# Altium schematic sheet Sheet_1.schdoc
size 366 x 250 mm
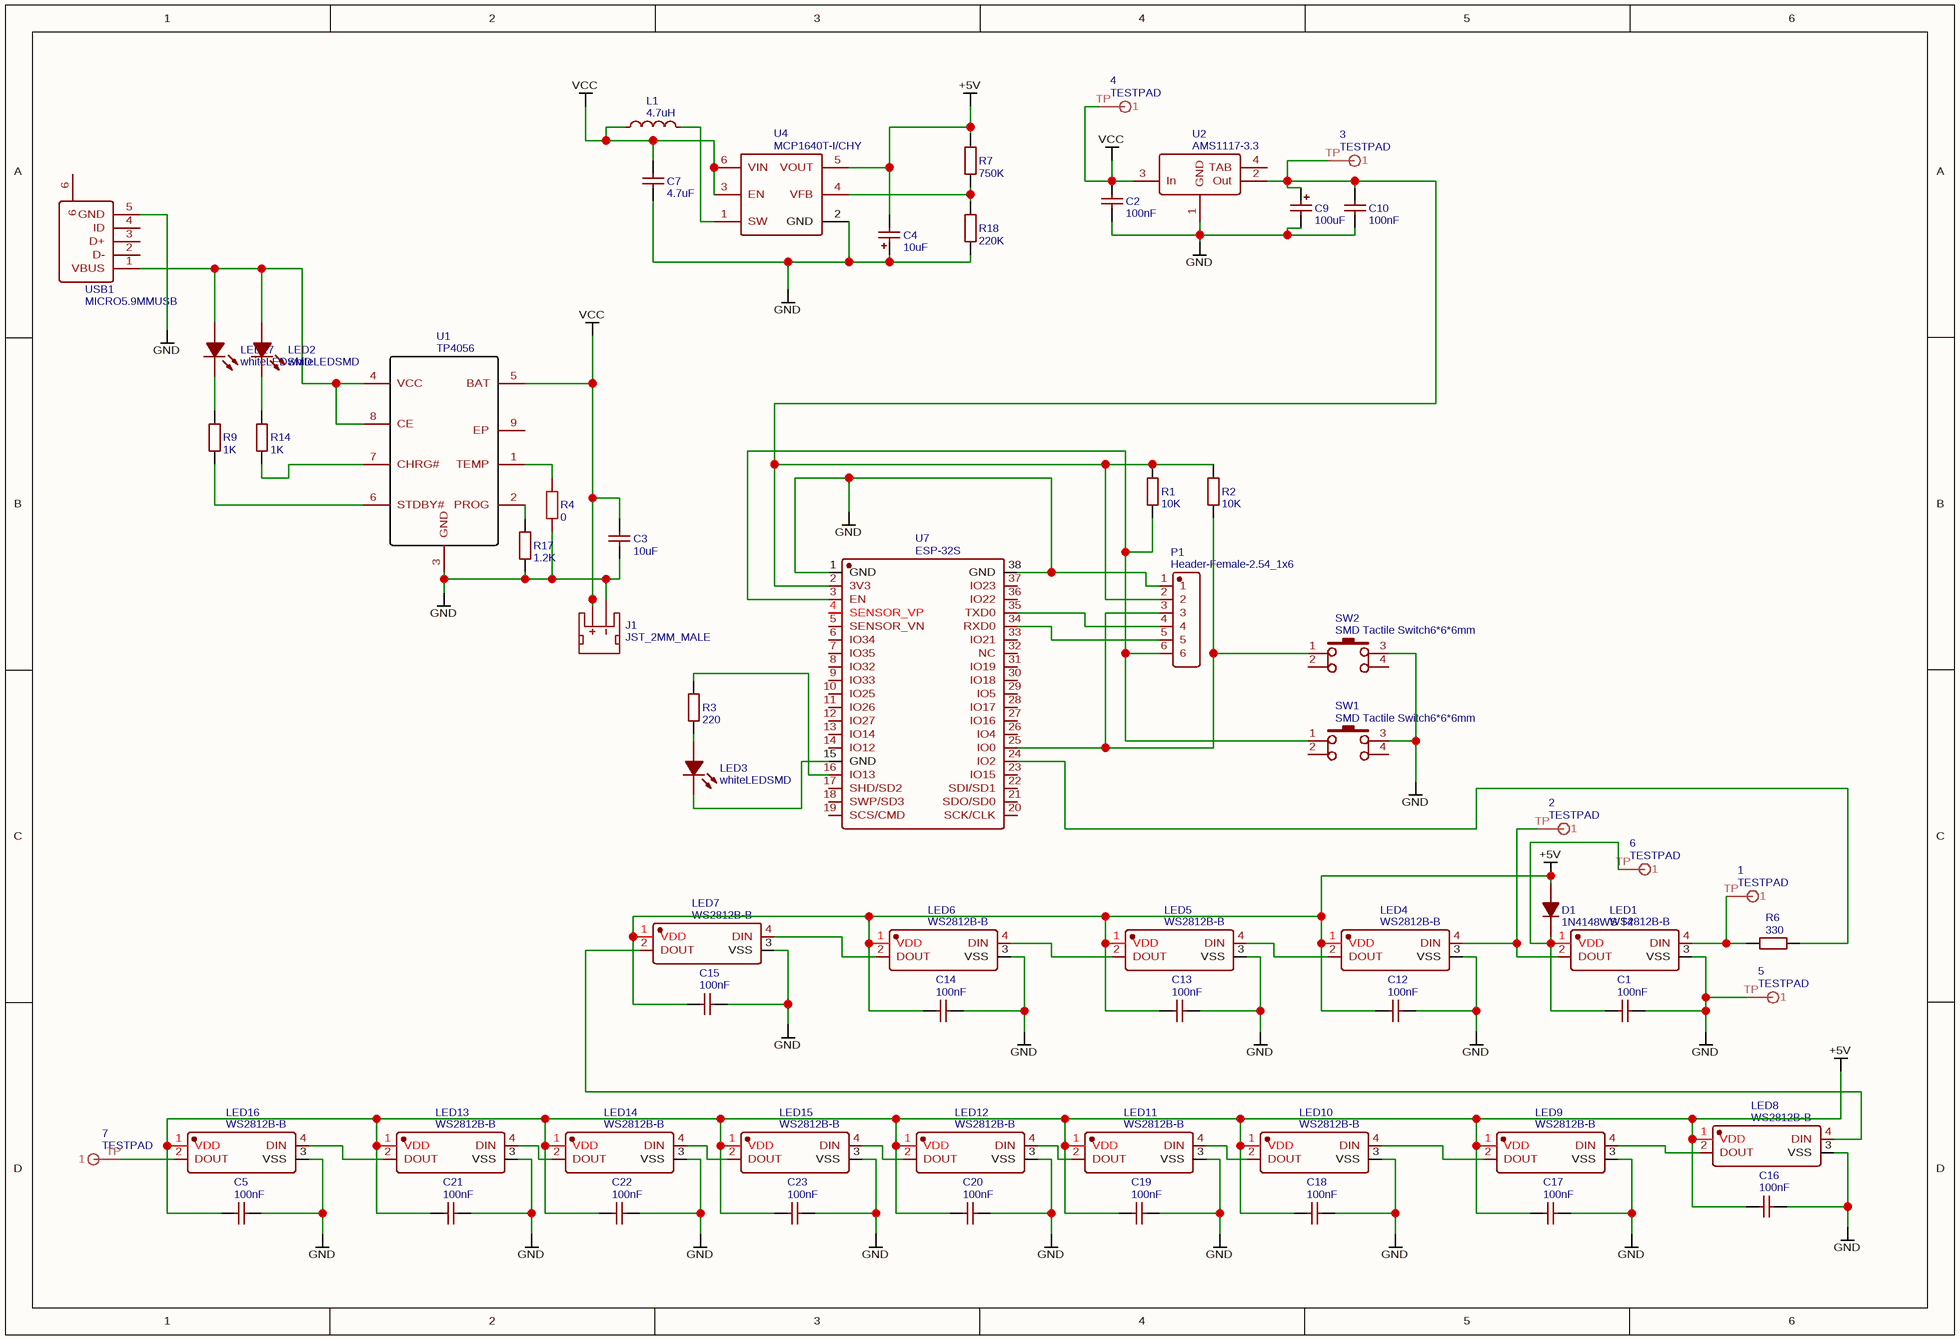
[diagram p0: Sheet_1.schdoc]

## Parts
1  TESTPAD  [TESTPAD]
2  TESTPAD  [TESTPAD]
3  TESTPAD  [TESTPAD]
4  TESTPAD  [TESTPAD]
5  TESTPAD  [TESTPAD]
6  TESTPAD  [TESTPAD]
7  TESTPAD  [TESTPAD]
C1  100nF  [0805]
C2  100nF  [0805]
C3  10uF  [0805]
C4  10uF  [CAP-SMD_L3.2-W1.6-R-RD]
C5  100nF  [0805]
C7  4.7uF  [1206]
C9  100uF  [CAP-SMD_L3.5-W2.8]
C10  100nF  [0805]
C12  100nF  [0805]
C13  100nF  [0805]
C14  100nF  [0805]
C15  100nF  [0805]
C16  100nF  [0805]
C17  100nF  [0805]
C18  100nF  [0805]
C19  100nF  [0805]
C20  100nF  [0805]
C21  100nF  [0805]
C22  100nF  [0805]
C23  100nF  [0805]
D1  1N4148WS T4  [SOD-323_L1.8-W1.3-LS2.5-FD]
J1  JST_2MM_MALE  [JST-2-SMD]
L1  4.7uH  [1812]
LED1  WS2812B-B  [LED-5050_4P]
LED2  whiteLEDSMD  [LED-0805]
LED3  whiteLEDSMD  [LED-0805]
LED4  WS2812B-B  [LED-5050_4P]
LED5  WS2812B-B  [LED-5050_4P]
LED6  WS2812B-B  [LED-5050_4P]
LED7  WS2812B-B  [LED-5050_4P]
LED8  WS2812B-B  [LED-5050_4P]
LED9  WS2812B-B  [LED-5050_4P]
LED10  WS2812B-B  [LED-5050_4P]
LED11  WS2812B-B  [LED-5050_4P]
LED12  WS2812B-B  [LED-5050_4P]
LED13  WS2812B-B  [LED-5050_4P]
LED14  WS2812B-B  [LED-5050_4P]
LED15  WS2812B-B  [LED-5050_4P]
LED16  WS2812B-B  [LED-5050_4P]
LED17  whiteLEDSMD  [LED-0805]
P1  Header-Female-2.54_1x6  [HDR-TH_6P-P2.54-V]
R1  10K  [0805]
R2  10K  [0805]
R3  220  [0402]
R4  0  [1206]
R6  330  [0603]
R7  750K  [0603]
R9  1K  [0805]
R14  1K  [0805]
R17  1.2K  [0805]
R18  220K  [0805]
SW1  SMD Tactile Switch6*6*6mm  [SW-SMD_4PIN-L6.00-W6.00]
SW2  SMD Tactile Switch6*6*6mm  [SW-SMD_4PIN-L6.00-W6.00]
U1  TP4056  [ESOP-8_L4.9-W3.9-P1.27-LS6.0-BL-EP]
U2  AMS1117-3.3  [SOT-223_L6.5-W3.5-P2.30-LS7.0-BR]
U4  MCP1640T-I/CHY  [SOT-23-6_L2.9-W1.6-P0.95-LS2.8-BL]
U7  ESP-32S  [WIFIM-SMD_ESP-32S]
USB1  MICRO5.9MMUSB  [MICRO-USB-SMD_5PIN-H-FEMALE-PITCH0.65-L_MICRO5.9MMUSB]

## Nets
+5V: C4.2 C5.1 C12.1 C13.1 C14.1 C15.1 C16.1 C17.1 C18.1 C19.1 C20.1 C21.1 C22.1 C23.1 D1.1(A) LED4.1(VDD) LED5.1(VDD) LED6.1(VDD) LED7.1(VDD) LED8.1(VDD) LED9.1(VDD) LED10.1(VDD) LED11.1(VDD) LED12.1(VDD) LED13.1(VDD) LED14.1(VDD) LED15.1(VDD) LED16.1(VDD) R7.2 U4.5(VOUT)
GND: 5.TP(1) C1.2 C2.1 C3.1 C4.1 C5.2 C7.1 C9.2 C10.1 C12.2 C13.2 C14.2 C15.2 C16.2 C17.2 C18.2 C19.2 C20.2 C21.2 C22.2 C23.2 J1.1(-) LED1.3(VSS) LED4.3(VSS) LED5.3(VSS) LED6.3(VSS) LED7.3(VSS) LED8.3(VSS) LED9.3(VSS) LED10.3(VSS) LED11.3(VSS) LED12.3(VSS) LED13.3(VSS) LED14.3(VSS) LED15.3(VSS) LED16.3(VSS) P1.1 R4.1 R17.1 R18.1 SW1.3 SW2.3 U1.3(GND) U2.1(GND) U4.2(GND) U7.1(GND) U7.38(GND) USB1.5(GND)
VCC: 4.TP(1) C2.2 C3.2 C7.2 J1.2(+) L1.1 U1.5(BAT) U2.3(In) U4.3(EN) U4.6(VIN)
Net1_TP: 1.TP(1) LED1.4(DIN) R6.1
Net2_TP: 2.TP(1) LED1.2(DOUT) LED4.4(DIN)
Net3_TP: 3.TP(1) C9.1 C10.2 P1.2 R1.2 R2.2 U2.2(Out) U7.2(3V3)
Net6_TP: 6.TP(1) C1.1 D1.2(K) LED1.1(VDD)
Net7_TP: 7.TP(1) LED16.2(DOUT)
NetL1_2: L1.2 U4.1(SW)
NetLED2_1: LED2.1(A) LED17.1(A) U1.4(VCC) U1.8(CE) USB1.1(VBUS)
NetLED2_2: LED2.2(K) R14.2
NetLED3_1: LED3.1(A) R3.1
NetLED3_2: LED3.2(K) U7.15(GND)
NetLED4_2: LED4.2(DOUT) LED5.4(DIN)
NetLED5_2: LED5.2(DOUT) LED6.4(DIN)
NetLED6_2: LED6.2(DOUT) LED7.4(DIN)
NetLED7_2: LED7.2(DOUT) LED8.4(DIN)
NetLED8_2: LED8.2(DOUT) LED9.4(DIN)
NetLED9_2: LED9.2(DOUT) LED10.4(DIN)
NetLED10_2: LED10.2(DOUT) LED11.4(DIN)
NetLED11_2: LED11.2(DOUT) LED12.4(DIN)
NetLED12_2: LED12.2(DOUT) LED15.4(DIN)
NetLED13_2: LED13.2(DOUT) LED16.4(DIN)
NetLED13_4: LED13.4(DIN) LED14.2(DOUT)
NetLED14_4: LED14.4(DIN) LED15.2(DOUT)
NetLED17_2: LED17.2(K) R9.2
NetP1_3: P1.3 R2.1 SW2.1 U7.25(IO0)
NetP1_4: P1.4 U7.35(TXD0)
NetP1_5: P1.5 U7.34(RXD0)
NetP1_6: P1.6 R1.1 SW1.1 U7.3(EN)
NetR3_2: R3.2 U7.16(IO13)
NetR4_2: R4.2 U1.1(TEMP)
NetR6_2: R6.2 U7.24(IO2)
NetR7_1: R7.1 R18.2 U4.4(VFB)
NetR9_1: R9.1 U1.6(STDBY#)
NetR14_1: R14.1 U1.7(CHRG#)
NetR17_2: R17.2 U1.2(PROG)

Not connected (* = marked no-connect by the designer): J1 NC1(PAD1) NC2(PAD2); SW1 2 4; SW2 2 4; U1 9(EP); U2 4(TAB); U7 4(SENSOR_VP) 5(SENSOR_VN) 6(IO34) 7(IO35) 8(IO32) 9(IO33) 10(IO25) 11(IO26) 12(IO27) 13(IO14) 14(IO12) 17(SHD/SD2) 18(SWP/SD3) 19(SCS/CMD) 20(SCK/CLK) 21(SDO/SD0) 22(SDI/SD1) 23(IO15) 26(IO4) 27(IO16) 28(IO17) 29(IO5) 30(IO18) 31(IO19) 32(NC) 33(IO21) 36(IO22) 37(IO23); USB1 2(D-) 3(D+) 4(ID) 6

## Library data of the parts
1-7 = TESTPAD: Contributor: Time God; spicePre: ?
C1 C2 C5 C10 C12-C23 = 100nF: BOM_Manufacturer Part: CC0805KRX7R9BB104; BOM_Manufacturer: YAGEO; nameAlias: Capacitance; SMT Type: Basic; BOM_Supplier: LCSC; BOM_LCSC Assembly: Yes; BOM_Supplier Part: C49678; spicePre: C; spiceSymbolName: CC0805KRX7R9BB104
C3 = 10uF: BOM_Manufacturer Part: CL21A106KAYNNNE; BOM_Manufacturer: SAMSUNG; nameAlias: Capacitance; SMT Type: Basic; BOM_Supplier: LCSC; BOM_LCSC Assembly: Yes; BOM_Supplier Part: C15850; spicePre: C; spiceSymbolName: CL21A106KAYNNNE
C4 = 10uF: BOM_Manufacturer: AVX; BOM_Manufacturer Part: TAJA106K016RNJ; nameAlias: Capacitance; SMT Type: Basic; BOM_Supplier: LCSC; BOM_LCSC Assembly: Yes; BOM_Supplier Part: C7171; spicePre: C; spiceSymbolName: TAJA106K016RNJ
C7 = 4.7uF: BOM_Manufacturer: FH; BOM_Manufacturer Part: 1206B475K500NT; nameAlias: Capacitance; SMT Type: Basic; BOM_Supplier: LCSC; BOM_LCSC Assembly: Yes; BOM_Supplier Part: C29823; spicePre: C; spiceSymbolName: 1206B475K500NT
C9 = 100uF: BOM_Manufacturer: AVX; BOM_Manufacturer Part: TAJB107K006RNJ; nameAlias: Capacitance; SMT Type: Basic; BOM_Supplier: LCSC; BOM_LCSC Assembly: Yes; BOM_Supplier Part: C16133; spicePre: C; spiceSymbolName: TAJB107K006RNJ
D1 = 1N4148WS T4: BOM_Manufacturer: CJ; SMT Type: Basic; BOM_Supplier: LCSC; BOM_Manufacturer Part: 1N4148WS T4; BOM_LCSC Assembly: Yes; image: //image.lceda.cn/szlcsc/C2128.jpg; BOM_Supplier Part: C2128; spicePre: D
J1 = JST_2MM_MALE: description: Mates to single-cell LiPo batteries.; Contributor: SparkFun; spicePre: J
L1 = 4.7uH: BOM_Manufacturer: MuRata; BOM_Manufacturer Part: LQH43MN4R7K03L; nameAlias: Inductance; SMT Type: Extend; BOM_Supplier: LCSC; BOM_Supplier Part: C86079; BOM_LCSC Assembly: Yes; spicePre: L; spiceSymbolName: LQH43MN4R7K03L
LED1 LED4-LED16 = WS2812B-B: BOM_Manufacturer: Worldsemi; Contributor: LCSC; BOM_Supplier: LCSC; BOM_Manufacturer Part: WS2812B-B; BOM_Supplier Part: C114586; spicePre: L
LED2 LED3 LED17 = whiteLEDSMD: BOM_Manufacturer: KENTO; SMT Type: Basic; BOM_Supplier: LCSC; BOM_Manufacturer Part: whiteLEDSMD; BOM_LCSC Assembly: Yes; image: //image.lceda.cn/szlcsc/C34499.jpg; BOM_Supplier Part: C34499; spicePre: L
P1 = Header-Female-2.54_1x6: BOM_Manufacturer: BOOMELE; BOM_Manufacturer Part: Female header 1*6p; BOM_Supplier: LCSC; BOM_Supplier Part: C40877; spicePre: P
R1 R2 = 10K: BOM_Manufacturer: UniOhm; BOM_Manufacturer Part: 0805W8F1002T5E; nameAlias: Resistance (Ohms); SMT Type: Basic; BOM_Supplier: LCSC; BOM_LCSC Assembly: Yes; BOM_Supplier Part: C17414; spicePre: R; spiceSymbolName: 0805W8F1002T5E
R3 = 220: BOM_Manufacturer: UniOhm; BOM_Manufacturer Part: 0402WGF2200TCE; nameAlias: Resistance (Ohms); SMT Type: Basic; BOM_Supplier: LCSC; BOM_LCSC Assembly: Yes; BOM_Supplier Part: C25091; spicePre: R; spiceSymbolName: 0402WGF2200TCE
R4 = 0: BOM_Manufacturer: KAMAYA; BOM_Manufacturer Part: RMC1/8JPTP; nameAlias: Resistance (Ohms); Contributor: LCSC; BOM_Supplier: LCSC; BOM_Supplier Part: C340518; spicePre: R; spiceSymbolName: RMC1/8JPTP
R6 = 330: BOM_Manufacturer: UniOhm; BOM_Manufacturer Part: 0603WAF3300T5E; nameAlias: Resistance (Ohms); SMT Type: Basic; BOM_Supplier: LCSC; BOM_LCSC Assembly: Yes; BOM_Supplier Part: C23138; spicePre: R; spiceSymbolName: 0603WAF3300T5E
R7 = 750K: BOM_Manufacturer: UniOhm; BOM_Manufacturer Part: 0603WAF7503T5E; nameAlias: Resistance (Ohms); SMT Type: Basic; BOM_Supplier: LCSC; BOM_LCSC Assembly: Yes; BOM_Supplier Part: C23240; spicePre: R; spiceSymbolName: 0603WAF7503T5E
R9 R14 = 1K: BOM_Manufacturer: UniOhm; BOM_Manufacturer Part: TC0525F1001T5E; nameAlias: Resistance (Ohms); SMT Type: Extend; BOM_Supplier: LCSC; BOM_Supplier Part: C75781; BOM_LCSC Assembly: Yes; spicePre: R; spiceSymbolName: TC0525F1001T5E
R17 = 1.2K: BOM_Manufacturer: UniOhm; BOM_Manufacturer Part: 0805W8F1201T5E; nameAlias: Resistance (Ohms); SMT Type: Basic; BOM_Supplier: LCSC; BOM_LCSC Assembly: Yes; BOM_Supplier Part: C17379; spicePre: R; spiceSymbolName: 0805W8F1201T5E
R18 = 220K: BOM_Manufacturer: UniOhm; BOM_Manufacturer Part: 0805W8F2203T5E; nameAlias: Resistance (Ohms); SMT Type: Basic; BOM_Supplier: LCSC; BOM_LCSC Assembly: Yes; BOM_Supplier Part: C17556; spicePre: R; spiceSymbolName: 0805W8F2203T5E
SW1 SW2 = SMD Tactile Switch6*6*6mm: BOM_Manufacturer: ReliaPro; BOM_Supplier Part: C23873; BOM_Supplier: LCSC; BOM_Manufacturer Part: SMD Tactile Switch6*6*6mm; image: http://image.lceda.cn/szlcsc/C23873.jpg; spicePre: S
U1 = TP4056: BOM_Manufacturer: TOPPOWER; Contributor: Guest; SMT Type: Basic; BOM_Supplier: LCSC; BOM_Manufacturer Part: TP4056; BOM_LCSC Assembly: Yes; image: //image.lceda.cn/szlcsc/C16581.jpg; BOM_Supplier Part: C16581; spicePre: U
U2 = AMS1117-3.3: BOM_Manufacturer: AMS; sourceId: dwIGgezVh; SMT Type: Basic; timeStamp: 1476261164; BOM_Supplier: LCSC; BOM_Manufacturer Part: AMS1117-3.3; BOM_LCSC Assembly: Yes; image: //image.lceda.cn/szlcsc/C6186.jpg; BOM_Supplier Part: C6186; spicePre: U
U4 = MCP1640T-I/CHY: BOM_Manufacturer: MICROCHIP; SMT Type: Extend; BOM_Supplier: LCSC; BOM_Manufacturer Part: MCP1640T-I/CHY; image: //image.lceda.cn/szlcsc/C44365.jpg; BOM_Supplier Part: C44365; BOM_LCSC Assembly: Yes; spicePre: U
U7 = ESP-32S: BOM_Manufacturer: Ai-Thinker; Contributor: LCSC; BOM_Supplier: LCSC; BOM_Supplier Part: C82899; BOM_Manufacturer Part: ESP-32S; spicePre: U
USB1 = MICRO5.9MMUSB: BOM_Manufacturer: SHOU HAN; Contributor: LCSC; BOM_Supplier: LCSC; BOM_Supplier Part: C393940; BOM_Manufacturer Part: MICRO5.9mmusb; spicePre: U